# Altium schematic sheet SCH Font conexion LCD display.SchDoc
size Legal; SheetNumber: 4; SheetTotal: 5
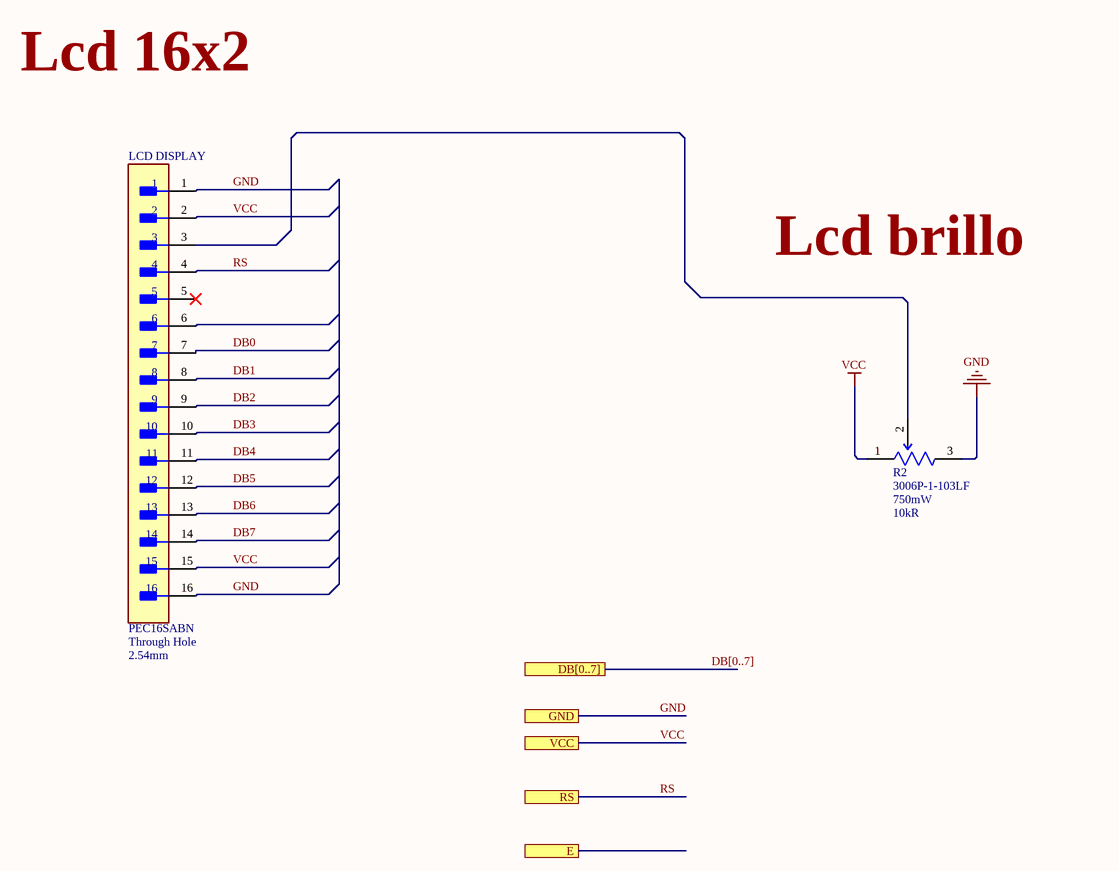
[diagram p0: SCH Font conexion LCD display.SchDoc]

## Parts
LCD_DISPLAY  PEC16SABN  Mount: Through Hole  Height: 2.54mm  [FP-PEC16SABN-MFG]
R2  3006P-1-103LF  Power Rating: 750mW  Resistance: 10kR  [FP-3006P-MFG]

## Ports
DB[0..7], E, GND, RS, VCC

## Nets
GND: LCD_DISPLAY.1 LCD_DISPLAY.16 R2.3(CW) ; port GND
VCC: LCD_DISPLAY.2 LCD_DISPLAY.15 R2.1(CCW) ; port VCC
DB0: LCD_DISPLAY.7
DB1: LCD_DISPLAY.8
DB2: LCD_DISPLAY.9
DB3: LCD_DISPLAY.10
DB4: LCD_DISPLAY.11
DB5: LCD_DISPLAY.12
DB6: LCD_DISPLAY.13
DB7: LCD_DISPLAY.14
RS: LCD_DISPLAY.4 ; port RS
NetLCD_DISPLAY_3: LCD_DISPLAY.3 R2.2(WIPER)

Not connected (* = marked no-connect by the designer): LCD_DISPLAY 5* 6

## Buses and harness runs
bus DB[0..7] = port DB[0..7]

## Notes on the sheet
- Lcd 16x2
- Lcd brillo

## Library data of the parts
LCD_DISPLAY = CMP-25680-000075-1: CONN HEADER VERT 16POS 2.54MM; Gender: Male; Number of Contacts: 16; Connector Type: Male Pin; Pitch: 0.1inch; Contact Type: Male Pin; Lead Free: Lead Free; Packaging: Bulk; Package Quantity: 1; Termination: Solder; Contact Plating: Tin; Color: Black; RoHS Compliant: Yes; Housing Material: Plastic; Contact Mating Length: 0.23inch; Number of Positions: 16; Width: 2.54mm; Contact Material: Bronze; Length: 40.6mm; Housing Color: Black; Number of Rows: 1
R2 = CMP-07234-000047-1: TRIMMER 10KOHM 0.75W PC PIN SIDE; Manufacturer Series: 3006; Pin Diameter: 0.6mm; Resistance Tolerance: 10%; Actuator Type: SCREW; Number of Turns: 15; Insulation Resistance: 1GR; Pitch: 2.5mm; Resistance Law: Linear; Temperature Coefficient: 100ppm/°C; Number of Terminals/Pins: 3; Actuator Orientation: Horizontal; Package Quantity: 100; Depth: 4.83mm; Width: 4.83mm; Termination: Pin; Packaging: Rail/Tube; Height: 6.35mm; Terminal Finish: Tin; Color: Blue; Thickness: 5.59mm; Lead Free: Lead Free; Min Operating Temperature: -55°C; Type: Potentiometer; Radiation Hardening: No; Weight: 0.04oz; Mount: Panel; RoHS Compliant: Yes; Length: 20.57mm; Tolerance: 10%; Number of Pins: 3; Taper: Linear; Military Standard: Not; Resistor Type: Cermet; Max Operating Temperature: 125°C; REACH SVHC: No SVHC; Technology: CERMET; Max Power Dissipation: 750mW; Series: 3006